# EAGLE schematic preamp (EAGLE 9.4.1)
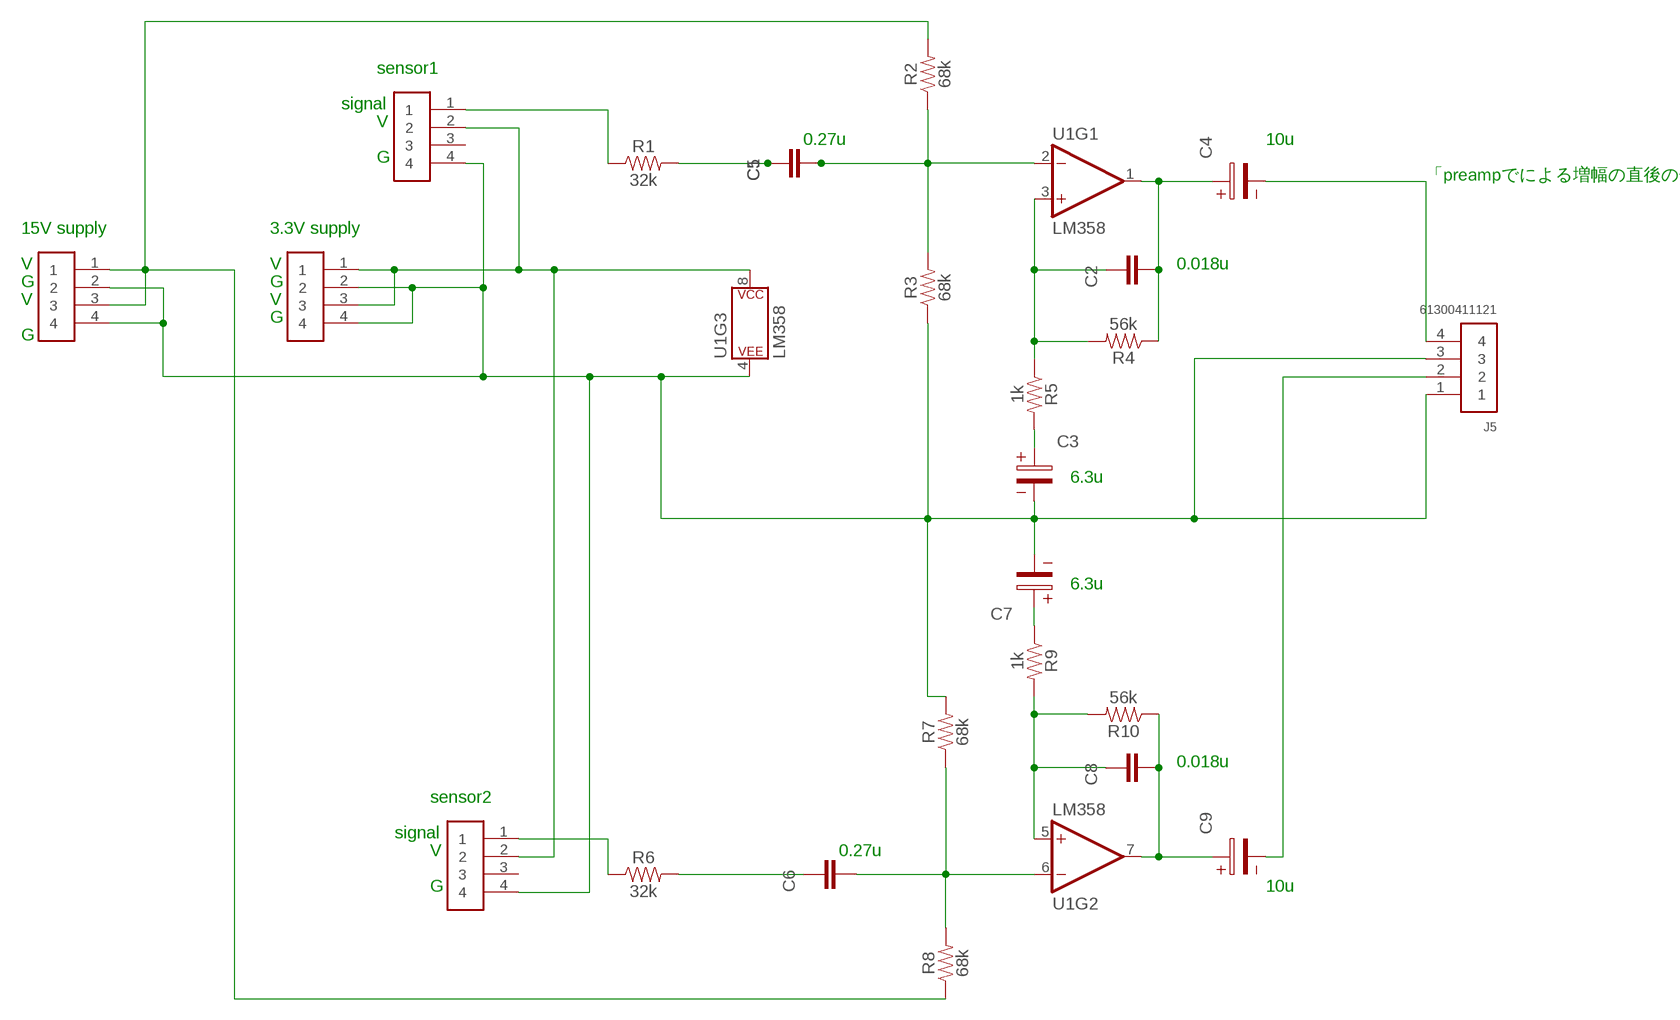
[diagram p0: schematic, sheet 1]

## Parts
C1  CC0603JRNPO9BN270  [CAP_0603]
C2  0.018u  CC0603JRNPO9BN270  [CAP_0603]
C3  WCAP-AI3H_25X30_861141084008  [25X10X2(DXPXΦ)]
C4  WCAP-AI3H_25X30_861141084008  [25X10X2(DXPXΦ)]
C5  0.27u  CC0603JRNPO9BN270  [CAP_0603]
C6  CC0603JRNPO9BN270  [CAP_0603]
C7  WCAP-AI3H_25X30_861141084008  [25X10X2(DXPXΦ)]
C8  CC0603JRNPO9BN270  [CAP_0603]
C9  WCAP-AI3H_25X30_861141084008  [25X10X2(DXPXΦ)]
J1  61300411121  [61300411121]
J2  61300411121  [61300411121]
J3  61300411121  [61300411121]
J4  61300411121  [61300411121]
J5  61300411121  [61300411121]
R1  32k  10MOHM-HORIZ-1/4W-5%  [AXIAL-0.3]
R2  68k  10MOHM-HORIZ-1/4W-5%  [AXIAL-0.3]
R3  68k  10MOHM-HORIZ-1/4W-5%  [AXIAL-0.3]
R4  56k  10MOHM-HORIZ-1/4W-5%  [AXIAL-0.3]
R5  1k  10MOHM-HORIZ-1/4W-5%  [AXIAL-0.3]
R6  32k  10MOHM-HORIZ-1/4W-5%  [AXIAL-0.3]
R7  68k  10MOHM-HORIZ-1/4W-5%  [AXIAL-0.3]
R8  68k  10MOHM-HORIZ-1/4W-5%  [AXIAL-0.3]
R9  1k  10MOHM-HORIZ-1/4W-5%  [AXIAL-0.3]
R10  56k  10MOHM-HORIZ-1/4W-5%  [AXIAL-0.3]
U1  LM358  [DIP08]

## Nets
N$1: C1.1 C5.1 R1.P$2
N$2: C1.2 C5.2 R2.P$1 R3.P$2 U1.2(-IN)
N$3: C2.1 R4.P$2 R5.P$1 U1.3(+IN)
N$4: C6.1 R6.P$2
N$5: C2.2 C4.1 R4.P$1 U1.1(OUT)
N$6: C3.1 R5.P$2
N$7: C6.2 R7.P$1 R8.P$2 U1.6(-IN)
N$8: C8.1 R9.P$2 R10.P$2 U1.5(+IN)
N$9: C8.2 C9.1 R10.P$1 U1.7(OUT)
N$10: C7.1 R9.P$1
N$11: J1.1 J1.3 J2.2 J3.2 U1.8(P$V+)
N$12: J3.1 R1.P$1
N$13: J2.1 R6.P$1
N$14: C3.2 C7.2 J1.2 J1.4 J2.4 J3.4 J4.2 J4.4 J5.1 J5.3 R3.P$1 R7.P$2 U1.4(P$V-)
N$15: C4.2 J5.4
N$16: C9.2 J5.2
N$17: J4.1 J4.3 R2.P$2 R8.P$1
Unconnected: J2.3 J3.3

## Notes on the sheet
- sensor1
- signal
- V
- 0.27u | 10u
- G
- 「preampでによる増幅の直後の信号」計測位置
- 15V supply | 3.3V supply
- V | V | 0.018u
- G | G
- V | V
- G
- G
- 6.3u
- 6.3u
- 0.018u
- sensor2
- signal
- V | 0.27u
- G | 10u

## Library data of the parts
C1 C2 C5 C6 C8 = Resistor_Capacitor:CC0603JRNPO9BN270: CAP CER 27PF 50V C0G/NPO 0603 Manufacturer's datasheet <http://www.yageo.com/documents/recent/UPY-GP_NP0_16V-to-50V_16.pdf>; CREATED_BY: PCBLayout.com; DIGIKEY_PART_NUMBER: 311-1063-2-ND; MANUFACTURER: Yageo; MPN: CC0603JRNPO9BN270; PACKAGE: SMD 0603
C3 C4 C7 C9 = Wurth_Elektronik_Passive_Capacitors_rev18b:WCAP-AI3H: WCAP-AI3H Aluminum Electrolytic Capacitors Characteristics Aluminum Electrolytic Capacitor Recommended soldering: Wave Operating temperature: -25 °C to +105 °C Extended lifetime product series Load life:3000 h @ +105 °C Package name and Variant abbreviation: Package: D X P X Φ = Diameter of the outline X Pitch of the hole X Diameter of the hole. <http://katalog.we-online.de/media/images/eisos/WCAP-AI3H_pf2.jpg> Details see: http://katalog.we-online.de/en/pbs/WCAP-AI3H?m Updated by: Yingchun,Shan Updated: 2017-03-16 2017 (C) Wurth Elektronik; WE-NUMBER: 861141084008/470uF
J1-J5 = Headers:61300411121: CONN HEADER VERT 4POS 2.54MM Manufacturer's datasheet <https://katalog.we-online.de/em/datasheet/6130xx11121.pdf>; CREATED_BY: PCBLayout.com; DIGI_KEY_PART_NUMBER: 732-5317-ND; MANUFACTURER: Wurth Electronics Inc.; MPN: 61300411121
R1-R10 = SparkFun-Resistors:10MOHM: RES-09327; PROD_ID: RES-09327; VALUE: 10M
U1 = SparkFun-IC-Amplifiers:LM358: LM358 Jellybean op-amp Datasheet <http://www.sparkfun.com/datasheets/Components/General/LM358.pdf> SparkFun Products Op-Amp (Thru-Hole) - LM358 <https://www.sparkfun.com/products/9456> (COM-09456); PROD_ID: IC-09172